# EAGLE schematic switch (EAGLE 6.5.0)
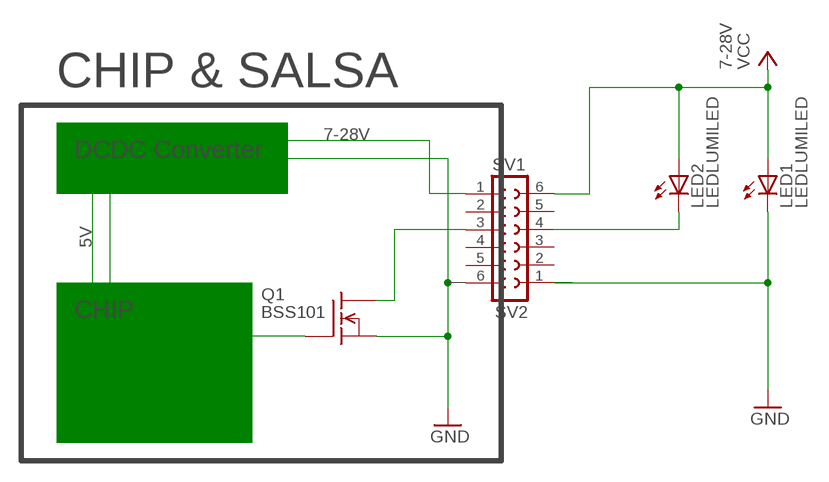
[diagram p0: schematic, sheet 1]

## Parts
LED1  LEDLUMILED  [LUMILED]
LED2  LEDLUMILED  [LUMILED]
Q1  BSS101  [TO92]
SV1  FE06-1  [FE06]
SV2  FE06-1  [FE06]

## Nets
GND: LED1.4-(C) Q1.1(S) SV1.1 SV2.6
N$2: LED2.4-(C) SV1.4
N$3: Q1.3(D) SV2.3
N$4: SV2.1
N$7: Q1.2(G)
VCC: LED1.2+(A) LED2.2+(A) SV1.6
Unconnected: SV1.2 SV1.3 SV1.5 SV2.2 SV2.4 SV2.5

## Notes on the sheet
- 7-28V
- CHIP & SALSA
- 7-28V
- DCDC Converter
- 5V
- CHIP

## Library data of the parts
LED1 LED2 = led-lumiled:LED: LED - LUMILED® LXK2-PW12-R00, LXK2-PW12-S00, LXK2-PW14-U00, LXK2-PW14-V00 LXK2-PM12-R00, LXK2-PM12-S00, LXK2-PM14-U00 LXK2-PE12-Q00, LXK2-PE12-R00, LXK2-PE12-S00, LXK2-PE14-T00, LXK2-PE14-U00 LXK2-PB12-K00, LXK2-PB12-L00, LXK2-PB12-M00, LXK2-PB14-N00, LXK2-PB14-P00, LXK2-PB14-Q00 LXK2-PR12-L00, LXK2-PR12-M00, LXK2-PR14-Q00, LXK2-PR14-R00 LXK2-PD12-Q00, LXK2-PD12-R00, LXK2-PD12-S00 LXK2-PH12-R00, LXK2-PH12-S00 LXK2-PL12-P00, LXK2-PL12-Q00, LXK2-PL12-R00 Source: www.luxeon.com; OC_FARNELL: unknown; OC_NEWARK: unknown
Q1 = transistor-fet:BSS101: N-Channel Enhancement MOSFET 200V; 0,16A; 11Ohm
SV1 SV2 = con-lsta:FE06-1: FEMALE HEADER; OC_FARNELL: unknown; OC_NEWARK: unknown